# Altium schematic sheet CSSUPPLY4_7.SCHDOC
size B
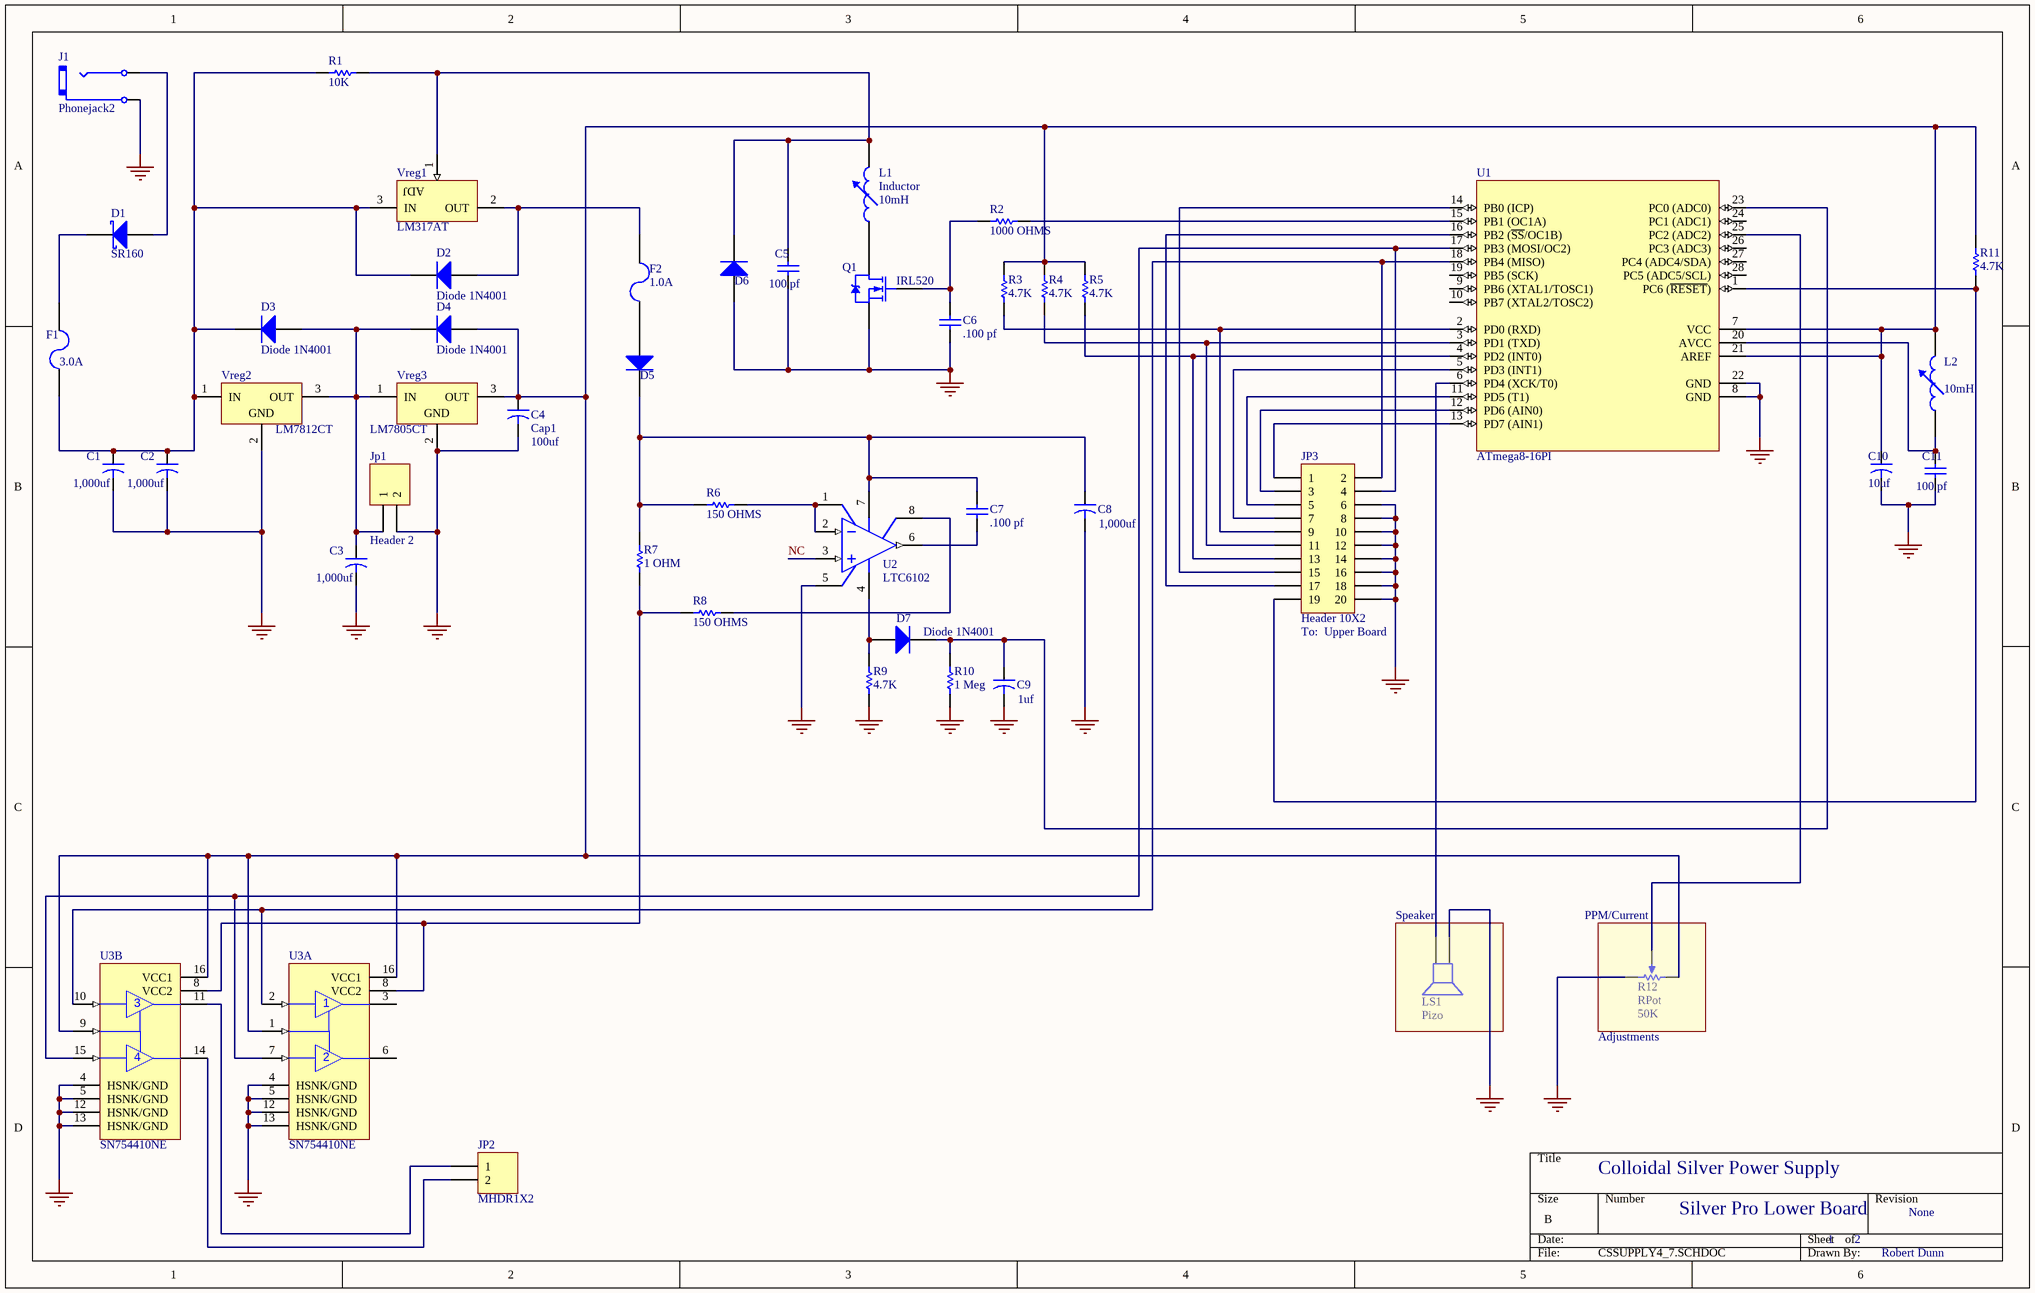
[diagram p0: CSSUPPLY4_7.SCHDOC]

## Parts
C1  value 1,000uf  [CAPPR7.5-16X35]  (hidden comment: Cap1)
C2  value 1,000uf  [CAPPR7.5-16X35]  (hidden comment: Cap1)
C3  value 1,000uf  [CAPPR7.5-16X35]  (hidden comment: Cap1)
C4  Cap1  value 100uf  [RAD-0.2]
C5  value 100 pf  [RAD-0.2]  (hidden comment: Cap)
C6  value .100 pf  [RAD-0.2]  (hidden comment: Cap)
C7  value .100 pf  [RAD-0.2]  (hidden comment: Cap)
C8  value 1,000uf  [CAPR5-4X5]  (hidden comment: Cap1)
C9  value 1uf  [CAPR5-4X5]  (hidden comment: Cap1)
C10  value 10uf  [CAPR5-4X5]  (hidden comment: Cap10)
C11  value 100 pf  [RAD-0.2]  (hidden comment: Cap)
D1  SR160  [DIO10.46-5.3x2.8]
D2  Diode 1N4001  [DIO10.46-5.3x2.8]
D3  Diode 1N4001  [DIO10.46-5.3x2.8]
D4  Diode 1N4001  [DIO10.46-5.3x2.8]
D5  Diode 1N4001  [DIO10.46-5.3x2.8]  (value not drawn)
D6  Diode 1N4001  [DIO10.46-5.3x2.8]  (value not drawn)
D7  Diode 1N4001  [DIO10.46-5.3x2.8]
F1  3.0A  [PIN-W2/E2.8]
F2  1.0A  [PIN-W2/E2.8]
J1  Phonejack2  [PIN2]
Jp1  Header 2  [HDR1X2]
JP2  MHDR1X2  [MHDR1X2]
JP3  Header 10X2  [HDR2X10]
L1  Inductor  value 10mH  [CAPPR5-5X5]
L2  value 10mH  [CAPPR5-5X5]  (hidden comment: Inductor Adj)
LS1  Pizo  [PIN2]
Q1  IRL520  [TO-220AB]
R1  value 10K  [AXIAL-0.4]  (hidden comment: Res1)
R2  value 1000 OHMS  [AXIAL-0.4]  (hidden comment: Res1)
R3  value 4.7K  [AXIAL-0.4]  (hidden comment: Res1)
R4  value 4.7K  [AXIAL-0.4]  (hidden comment: Res1)
R5  value 4.7K  [AXIAL-0.4]  (hidden comment: Res1)
R6  value 150 OHMS  [AXIAL-0.4]  (hidden comment: Res1)
R7  value 1 OHM  [AXIAL-0.5]  (hidden comment: Res1)
R8  value 150 OHMS  [AXIAL-0.4]  (hidden comment: Res1)
R9  value 4.7K  [AXIAL-0.4]  (hidden comment: Res1)
R10  value 1 Meg  [AXIAL-0.4]  (hidden comment: Res1)
R11  value 4.7K  [AXIAL-0.4]  (hidden comment: Res1)
R12  RPot  value 50K  [VR5]
U1  ATmega8-16PI  [28P3]
U2  LTC6102  [MS8]
U3  SN754410NE  [NE016]  (parts A,B of 2)
Vreg1  LM317AT  [T03B]
Vreg2  LM7812CT  [T03B]
Vreg3  LM7805CT  [T03B]

## Blocks framed on the sheet
Speaker: LS1

## Nets
GND: C1.2 C2.2 C3.2 C4.2 C5.1 C6.1 C8.2 C9.2 C10.2 C11.1 D6.1(A) J1.2(B) Jp1.2 JP3.6 JP3.8 JP3.10 JP3.12 JP3.14 JP3.16 JP3.18 JP3.20 LS1.1 Q1.3(S) R9.1 R10.1 R12.2(BOT) U1.8(GND) U1.22(GND) U2.5(EXT_CLKI) U3.4(HSNK/GND) U3.5(HSNK/GND) U3.12(HSNK/GND) U3.13(HSNK/GND) Vreg2.2(GND) Vreg3.2(GND)
NC: U2.3(IN+)
NetC1_1: C1.1 C2.1 D2.2(K) D3.2(K) F1.1 R1.2 Vreg1.3(IN) Vreg2.1(IN)
NetC3_1: C3.1 D3.1(A) D4.2(K) Jp1.1 Vreg2.3(OUT) Vreg3.1(IN)
NetC4_1: C4.1 C10.1 D4.1(A) L2.2 R3.1 R4.1 R5.1 R11.2 R12.1(TOP) U1.7(VCC) U1.21(AREF) U3.1(1,2EN) U3.9(3,4EN) U3.16(VCC1) Vreg3.3(OUT)
NetC5_2: C5.2 D6.2(K) L1.2 R1.1 Vreg1.1(ADJ)
NetC6_2: C6.2 Q1.1(G) R2.2
NetC7_1: C7.1 U2.6(OUT)
NetC7_2: C7.2 C8.1 D5.2(K) R6.2 R7.1 U2.7(V+)
NetC9_1: C9.1 D7.2(K) R10.2 U1.23(PC0_(ADC0))
NetC11_2: C11.2 L2.1 U1.20(AVCC)
NetD1_1: D1.1(A) J1.1(A)
NetD1_2: D1.2(K) F1.2
NetD2_1: D2.1(A) F2.1 Vreg1.2(OUT)
NetD5_1: D5.1(A) F2.2
NetD7_1: D7.1(A) R9.2 U2.4(V-)
NetJP2_1: JP2.1 U3.11(3Y)
NetJP2_2: JP2.2 U3.14(4Y)
NetJP3_1: JP3.1 U1.13(PD7_(AIN1))
NetJP3_2: JP3.2 U1.18(PB4_(MISO)) U3.2(1A) U3.10(3A)
NetJP3_3: JP3.3 U1.12(PD6_(AIN0))
NetJP3_4: JP3.4 U1.17(PB3_(MOSI/OC2)) U3.7(2A) U3.15(4A)
NetJP3_5: JP3.5 U1.11(PD5_(T1))
NetJP3_7: JP3.7 U1.5(PD3_(INT1))
NetJP3_9: JP3.9 R3.2 U1.2(PD0_(RXD))
NetJP3_11: JP3.11 R4.2 U1.3(PD1_(TXD))
NetJP3_13: JP3.13 R5.2 U1.4(PD2_(INT0))
NetJP3_15: JP3.15 U1.14(PB0_(ICP))
NetJP3_17: JP3.17 U1.16(PB2_(~{SS}/OC1B))
NetJP3_19: JP3.19 R11.1 U1.1(PC6_(~{RESET}))
NetL1_1: L1.1 Q1.2(D)
NetLS1_2: LS1.2 U1.6(PD4_(XCK/T0))
NetR2_1: R2.1 U1.15(PB1_(OC1A))
NetR6_1: R6.1 U2.1(ISU) U2.2(IN-)
NetR7_2: R7.2 R8.2 U3.8(VCC2)
NetR8_1: R8.1 U2.8(CLKO)
NetR12_3: R12.3(TAP) U1.25(PC2_(ADC2))

Not connected (* = marked no-connect by the designer): U1 9(PB6_(XTAL1/TOSC1)) 10(PB7_(XTAL2/TOSC2)) 19(PB5_(SCK)) 24(PC1_(ADC1)) 26(PC3_(ADC3)) 27(PC4_(ADC4/SDA)) 28(PC5_(ADC5/SCL)); U3 3(1Y) 6(2Y)

## Notes on the sheet
- (near JP3) To:  Upper Board
- (near R12) PPM/Current
- Adjustments
- Colloidal Silver Power Supply
- Silver Pro Lower Board
- 1
- 2
- None
- Robert Dunn

## Library data of the parts
C1-C4 C8-C10 = Cap2: Capacitor; Published: 23-Sep-2002; Publisher: Altium Limited
C5-C7 C11 = Cap: Capacitor; Published: 8-Jun-2000; Revision: July-2002: Re-released for DXP Platform.; Publisher: Altium Limited
D1 = Diode 11DQ03: Schottky Rectifier; Revision 1: 10-Jul-2000: SIM Model Added.; Revision 2: 17-Jul-2002: Re-released for DXP Platform.; Code - JEDEC: DO-204-AL; Published: 8-Jun-2000; Datasheet: Latest Revision: Dec-1997; Package Reference: DO-204AL; Publisher: Altium Limited
D2-D7 = Diode 1N4001: 1 Amp General Purpose Rectifier; Revision 1: 11-Jul-2000: SIM Model Added.; Revision 2: 17-Jul-2002: Re-released for DXP Platform.; Package Information: Latest Revision: Aug-1999; Code - JEDEC: DO-204-AL; Published: 8-Jun-2000; Datasheet: Latest Revision: 1998; Package Reference: DO-41; Publisher: Altium Limited
F1 F2 = Fuse 2: Fuse; Published: 8-Jun-2000; Revision: July-2002: Re-released for DXP Platform.; Publisher: Altium Limited
J1 = Phonejack2: 2-Conductor Jack; Revision: 17-Jul-2002: Re-released for DXP Platform.; Publisher: Altium Limited
Jp1 = Header 2: Header, 2-Pin; Revision: 17-Jul-2002: Re-released for DXP Platform.; Publisher: Altium Limited
JP2 = MHDR1X2: Header, 2-Pin; Revision: 17-Jul-2002: Re-released for DXP Platform.; Publisher: Altium Limited
JP3 = Header 10X2: Header, 10-Pin, Dual row; Revision: 17-Jul-2002: Re-released for DXP Platform.; Publisher: Altium Limited
L1 L2 = Inductor Adj: Adjustable Inductor; Set Position: 0.5; Published: 24-Mar-1999; Revision: July-2002: Re-released for DXP Platform.; Publisher: Altium Limited
LS1 = Speaker: Loudspeaker; Published: 24-Mar-1999; Revision: July-2002: Re-released for DXP Platform.; Publisher: Altium Limited
Q1 = IRL520: HEXFET N-Channel Power MOSFET; Revision 1: 10-Jul-2000: SIM Model Added.; Revision 2: 17-Jul-2002: Re-released for DXP Platform.; Package Information: Latest Revision: Feb-1997; Note: Pin 2 is electrically connected to pin 4.; Published: 8-Jun-2000; Datasheet: Latest Revision: PD-9.561C; Package Reference: TO-220AB; Publisher: Altium Limited
R1-R11 = Res1: Resistor; Published: 8-Jun-2000; Revision: July-2002: Re-released for DXP Platform.; Publisher: Altium Limited
R12 = RPot: Potentiometer; pin to pad: 1>2 2>1; Set Position: 0.5; Published: 8-Jun-2000; Revision: July-2002: Re-released for DXP Platform.; Publisher: Altium Limited
U1 = ATmega8-16PI: 8-Bit AVR Microcontroller with 8K Bytes of In-System Programmable Flash Memory; Package Information: Latest Revision: revB, Sep-2001; Published: 17-Sep-2003; Datasheet: Latest Revision: 2486H-AVR-09/02; Package Reference: 28P3; Publisher: Altium Limited
U2 = LTC1150CS8: ?5V Chopper Stabilised Operational Amplifier with Internal Capacitors; Revision 1: 10-Jul-2000: SIM Model Added.; Revision 2: 17-Jul-2002: Re-released for DXP Platform.; Code - JEDEC: MS-012-AA; Code - IPC: SO8; Published: 8-Jun-2000; Datasheet: Latest Revision: Jun-1991; Package Reference: S8; Publisher: Altium Limited
U3 = SN754410NE: Quadruple Half-H Driver; Package Information: Latest Revision: 1991; Code - JEDEC: MS-001-BB; Published: 15-May-2002; Datasheet: 1991 Interface Circuits Data Book (May-1990); Package Reference: NE016; Publisher: Altium Limited
Vreg1 = LM317AT: 3-Terminal Adjustable Regulator; Package Information: Latest Revision: 1995; Published: 15-Apr-2002; Datasheet: Latest Revision: Aug-1999; Package Reference: T03B; Publisher: Altium Limited
Vreg2 Vreg3 = LM7805CT: Series 3-Terminal Positive Regulator; Package Information: Latest Revision: 1995; Note: Tab is connected to GND; Published: 15-Apr-2002; Datasheet: Latest Revision: May-1999; Package Reference: T03B; Publisher: Altium Limited